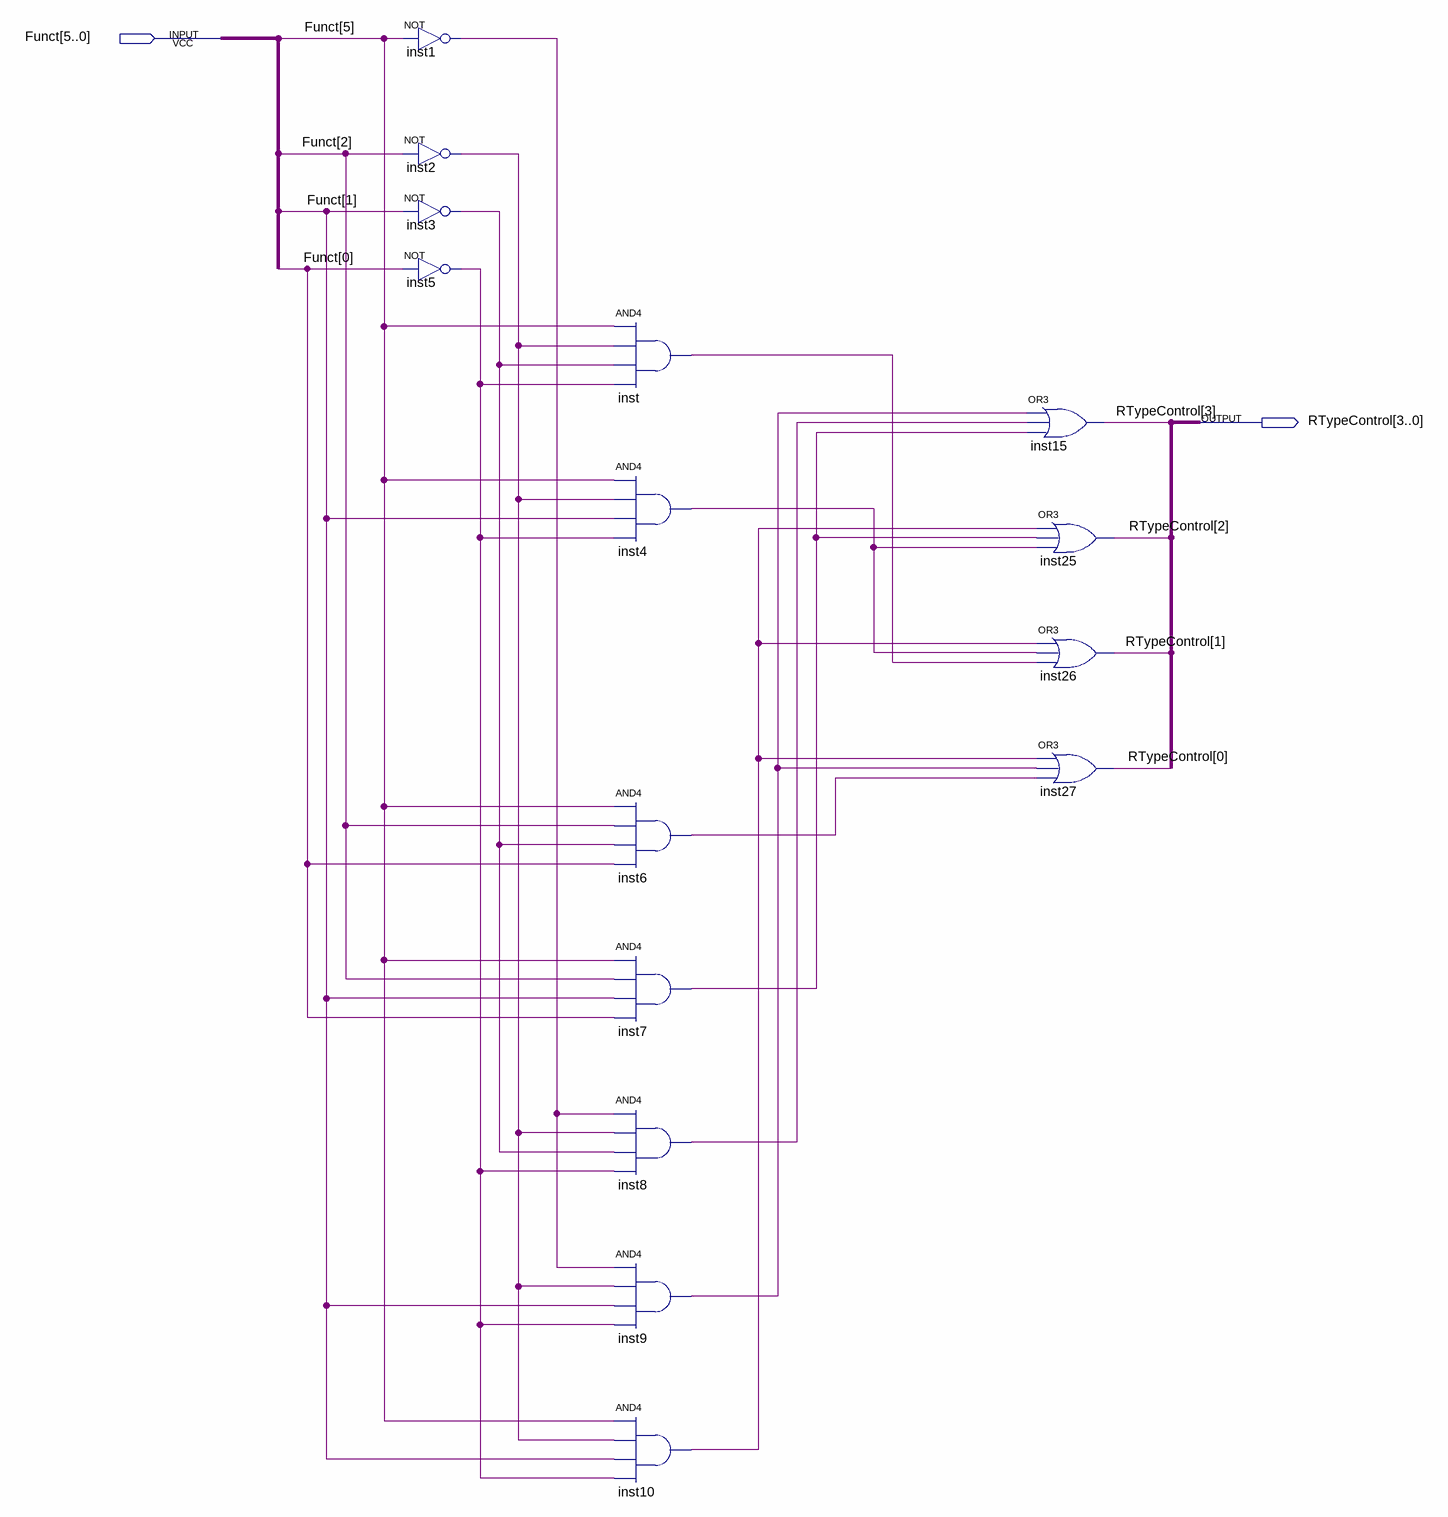
[diagram p0: schematic sheet]
// Quartus schematic RTypeControl.bdf as structural Verilog: 15 symbols, 2 pins
module RTypeControl (
  input  [5:0] Funct,
  output [3:0] RTypeControl
);

  wire inst1_out, inst2_out, inst3_out, inst4_out, inst5_out, inst6_out, inst7_out, inst8_out, inst9_out,
       inst10_out, inst_out;

  not inst1 (inst1_out, Funct[5]);
  not inst2 (inst2_out, Funct[2]);
  not inst3 (inst3_out, Funct[1]);
  not inst5 (inst5_out, Funct[0]);
  and inst (inst_out, Funct[5], inst2_out, inst3_out, inst5_out);
  and inst4 (inst4_out, Funct[5], inst2_out, Funct[1], inst5_out);
  and inst6 (inst6_out, Funct[5], Funct[2], inst3_out, Funct[0]);
  and inst7 (inst7_out, Funct[5], Funct[2], Funct[1], Funct[0]);
  and inst8 (inst8_out, inst1_out, inst2_out, inst3_out, inst5_out);
  and inst9 (inst9_out, inst1_out, inst2_out, Funct[1], inst5_out);
  and inst10 (inst10_out, Funct[5], inst2_out, Funct[1], inst5_out);
  or inst15 (RTypeControl[3], inst9_out, inst8_out, inst7_out);
  or inst25 (RTypeControl[2], inst10_out, inst7_out, inst4_out);
  or inst26 (RTypeControl[1], inst10_out, inst4_out, inst_out);
  or inst27 (RTypeControl[0], inst10_out, inst9_out, inst6_out);
endmodule
